# EAGLE design registers_half_copy (EAGLE 9.5.2)
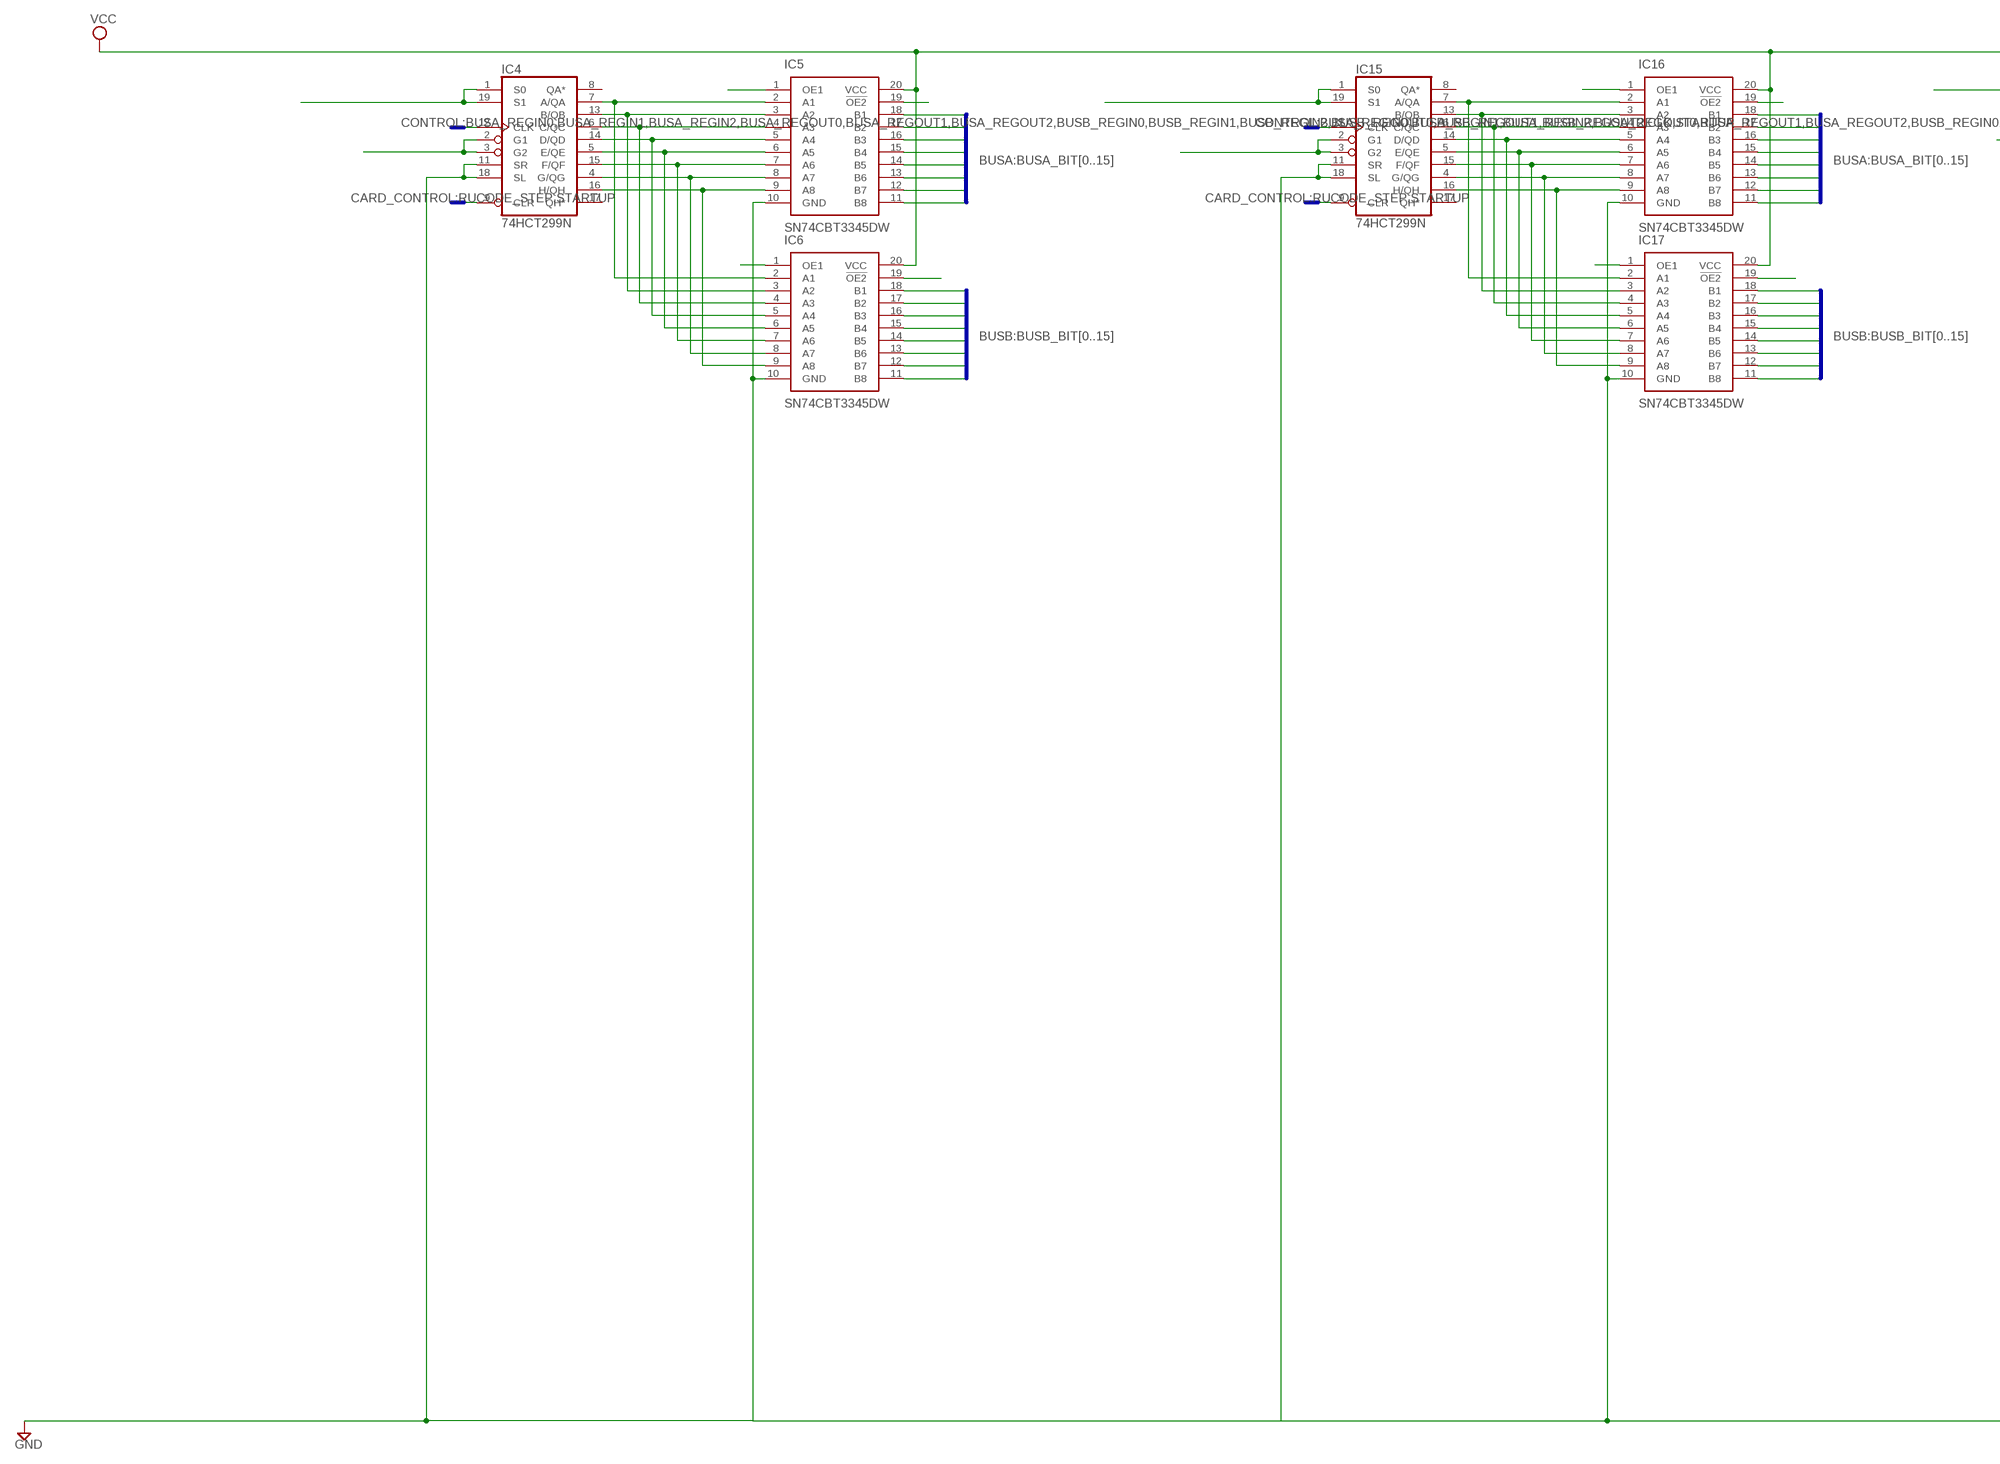
[diagram p0: schematic, sheet 1, part 1 of 2]
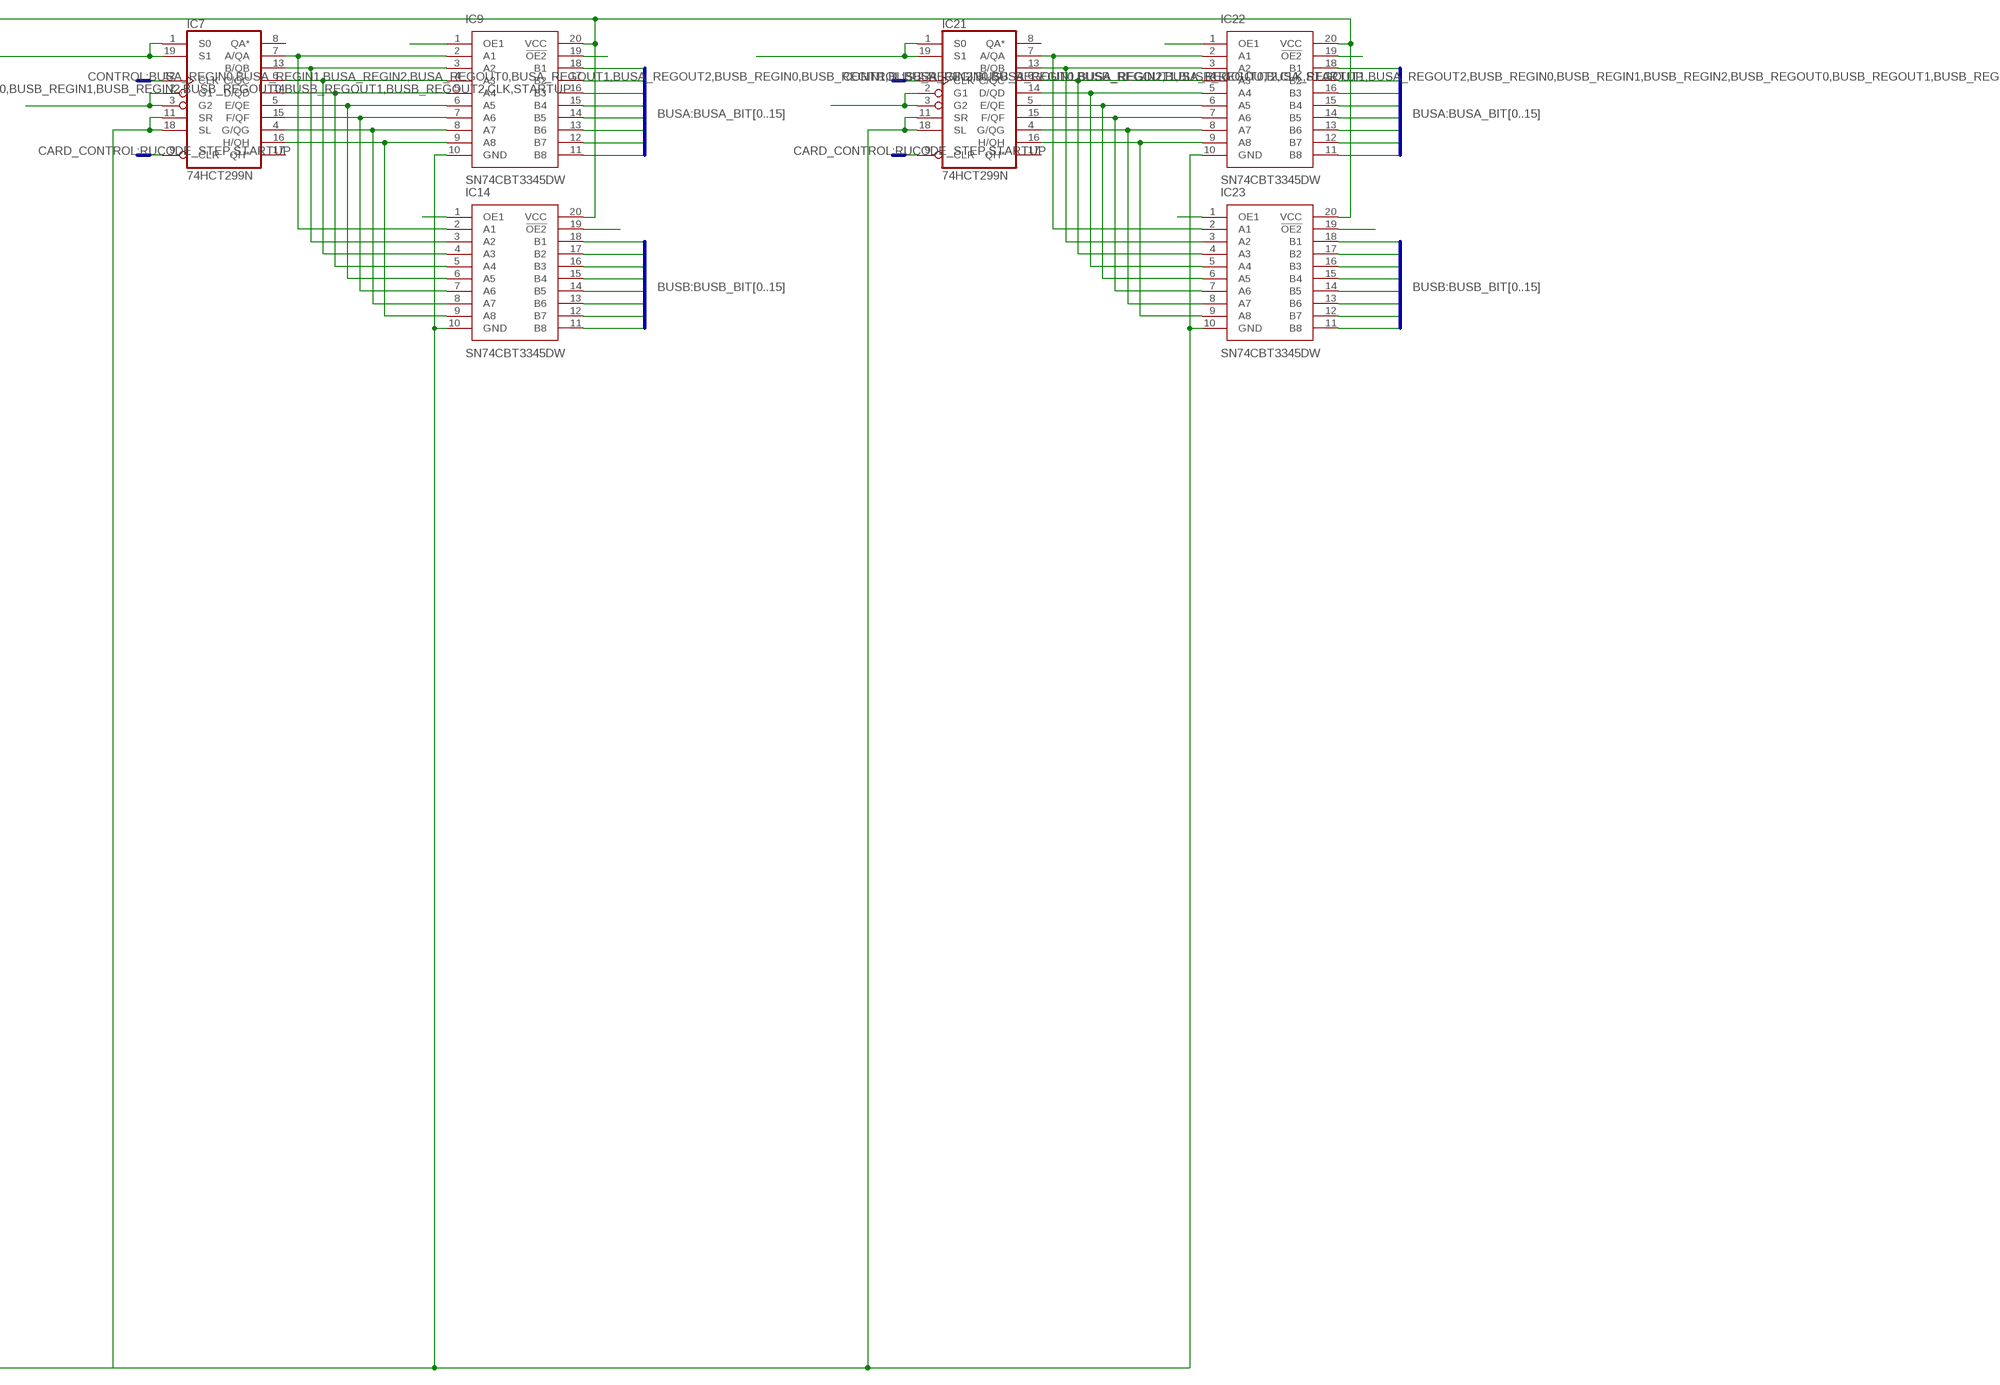
[diagram p1: schematic, sheet 1, part 2 of 2]

## Parts
IC4  74HCT299N  [DIL20]
IC5  SN74CBT3345DW  [SOIC127P1030X265-20N]
IC6  SN74CBT3345DW  [SOIC127P1030X265-20N]
IC7  74HCT299N  [DIL20]
IC9  SN74CBT3345DW  [SOIC127P1030X265-20N]
IC14  SN74CBT3345DW  [SOIC127P1030X265-20N]
IC15  74HCT299N  [DIL20]
IC16  SN74CBT3345DW  [SOIC127P1030X265-20N]
IC17  SN74CBT3345DW  [SOIC127P1030X265-20N]
IC21  74HCT299N  [DIL20]
IC22  SN74CBT3345DW  [SOIC127P1030X265-20N]
IC23  SN74CBT3345DW  [SOIC127P1030X265-20N]

## Nets
BUSA_BIT0: IC5.18(B1) IC9.18(B1) IC16.18(B1) IC22.18(B1)
BUSA_BIT1: IC5.17(B2) IC9.17(B2) IC16.17(B2) IC22.17(B2)
BUSA_BIT2: IC5.16(B3) IC9.16(B3) IC16.16(B3) IC22.16(B3)
BUSA_BIT3: IC5.15(B4) IC9.15(B4) IC16.15(B4) IC22.15(B4)
BUSA_BIT4: IC5.14(B5) IC9.14(B5) IC16.14(B5) IC22.14(B5)
BUSA_BIT5: IC5.13(B6) IC9.13(B6) IC16.13(B6) IC22.13(B6)
BUSA_BIT6: IC5.12(B7) IC9.12(B7) IC16.12(B7) IC22.12(B7)
BUSA_BIT7: IC5.11(B8) IC9.11(B8) IC16.11(B8) IC22.11(B8)
BUSB_BIT0: IC6.18(B1) IC14.18(B1) IC17.18(B1) IC23.18(B1)
BUSB_BIT1: IC6.17(B2) IC14.17(B2) IC17.17(B2) IC23.17(B2)
BUSB_BIT2: IC6.16(B3) IC14.16(B3) IC17.16(B3) IC23.16(B3)
BUSB_BIT3: IC6.15(B4) IC14.15(B4) IC17.15(B4) IC23.15(B4)
BUSB_BIT4: IC6.14(B5) IC14.14(B5) IC17.14(B5) IC23.14(B5)
BUSB_BIT5: IC6.13(B6) IC14.13(B6) IC17.13(B6) IC23.13(B6)
BUSB_BIT6: IC6.12(B7) IC14.12(B7) IC17.12(B7) IC23.12(B7)
BUSB_BIT7: IC6.11(B8) IC14.11(B8) IC17.11(B8) IC23.11(B8)
CLK: IC4.12(CLK) IC7.12(CLK) IC15.12(CLK) IC21.12(CLK)
GND: IC4.11(SR) IC4.18(SL) IC5.10(GND) IC6.10(GND) IC7.11(SR) IC7.18(SL) IC9.10(GND) IC14.10(GND) IC15.11(SR) IC15.18(SL) IC16.10(GND) IC17.10(GND) IC21.11(SR) IC21.18(SL) IC22.10(GND) IC23.10(GND)
N$1: IC5.19(!OE2)
N$2: IC23.1(OE1)
N$3: IC4.2(G1) IC4.3(G2)
N$4: IC4.1(S0) IC4.19(S1)
N$5: IC4.7(A/QA) IC5.2(A1) IC6.2(A1)
N$6: IC4.13(B/QB) IC5.3(A2) IC6.3(A2)
N$7: IC4.6(C/QC) IC5.4(A3) IC6.4(A3)
N$8: IC4.14(D/QD) IC5.5(A4) IC6.5(A4)
N$9: IC4.5(E/QE) IC5.6(A5) IC6.6(A5)
N$10: IC4.15(F/QF) IC5.7(A6) IC6.7(A6)
N$11: IC4.4(G/QG) IC5.8(A7) IC6.8(A7)
N$14: IC16.19(!OE2)
N$15: IC4.16(H/QH) IC5.9(A8) IC6.9(A8)
N$17: IC7.2(G1) IC7.3(G2)
N$18: IC17.19(!OE2)
N$19: IC7.1(S0) IC7.19(S1)
N$20: IC16.1(OE1)
N$22: IC7.7(A/QA) IC9.2(A1) IC14.2(A1)
N$23: IC7.13(B/QB) IC9.3(A2) IC14.3(A2)
N$24: IC7.6(C/QC) IC9.4(A3) IC14.4(A3)
N$25: IC7.14(D/QD) IC9.5(A4) IC14.5(A4)
N$26: IC17.1(OE1)
N$27: IC9.1(OE1)
N$28: IC7.5(E/QE) IC9.6(A5) IC14.6(A5)
N$29: IC14.1(OE1)
N$30: IC9.19(!OE2)
N$31: IC14.19(!OE2)
N$32: IC6.1(OE1)
N$33: IC6.19(!OE2)
N$34: IC5.1(OE1)
N$35: IC7.15(F/QF) IC9.7(A6) IC14.7(A6)
N$36: IC7.4(G/QG) IC9.8(A7) IC14.8(A7)
N$37: IC7.16(H/QH) IC9.9(A8) IC14.9(A8)
N$39: IC15.2(G1) IC15.3(G2)
N$40: IC15.1(S0) IC15.19(S1)
N$41: IC15.7(A/QA) IC16.2(A1) IC17.2(A1)
N$42: IC15.13(B/QB) IC16.3(A2) IC17.3(A2)
N$43: IC15.6(C/QC) IC16.4(A3) IC17.4(A3)
N$44: IC15.14(D/QD) IC16.5(A4) IC17.5(A4)
N$45: IC15.5(E/QE) IC16.6(A5) IC17.6(A5)
N$46: IC15.15(F/QF) IC16.7(A6) IC17.7(A6)
N$47: IC15.4(G/QG) IC16.8(A7) IC17.8(A7)
N$48: IC15.16(H/QH) IC16.9(A8) IC17.9(A8)
N$50: IC22.1(OE1)
N$52: IC22.19(!OE2)
N$53: IC23.19(!OE2)
N$61: IC21.2(G1) IC21.3(G2)
N$62: IC21.1(S0) IC21.19(S1)
N$63: IC21.7(A/QA) IC22.2(A1) IC23.2(A1)
N$64: IC21.13(B/QB) IC22.3(A2) IC23.3(A2)
N$65: IC21.6(C/QC) IC22.4(A3) IC23.4(A3)
N$66: IC21.14(D/QD) IC22.5(A4) IC23.5(A4)
N$67: IC21.5(E/QE) IC22.6(A5) IC23.6(A5)
N$68: IC21.15(F/QF) IC22.7(A6) IC23.7(A6)
N$69: IC21.4(G/QG) IC22.8(A7) IC23.8(A7)
N$70: IC21.16(H/QH) IC22.9(A8) IC23.9(A8)
STARTUP: IC4.9(CLR) IC7.9(CLR) IC15.9(CLR) IC21.9(CLR)
VCC: IC5.20(VCC) IC6.20(VCC) IC9.20(VCC) IC14.20(VCC) IC16.20(VCC) IC17.20(VCC) IC22.20(VCC) IC23.20(VCC)
Unconnected: IC4.8(QA*) IC4.17(QH*) IC7.8(QA*) IC7.17(QH*) IC15.8(QA*) IC15.17(QH*) IC21.8(QA*) IC21.17(QH*)

## Buses
CONTROL:BUSA_REGIN0,BUSA_REGIN1,BUSA_REGIN2,BUSA_REGOUT0,BUSA_REGOUT1,BUSA_REGOUT2,BUSB_REGIN0,BUSB_REGIN1,BUSB_REGIN2,BUSB_REGOUT0,BUSB_REGOUT1,BUSB_REGOUT2,CLK,STARTUP
CARD_CONTROL:RUCODE_STEP,STARTUP
BUSA:BUSA_BIT[0..15]
BUSB:BUSB_BIT[0..15]

## Power pins joined to a net without a drawn wire
GND: IC4.10(GND) IC7.10(GND) IC15.10(GND) IC21.10(GND)
VCC: IC4.20(VCC) IC7.20(VCC) IC15.20(VCC) IC21.20(VCC)

## Library data of the parts
IC4 IC7 IC15 IC21 = 74xx-eu:74*299: 8-bit universal SHIFT/STORAGE REGISTER
IC5 IC6 IC9 IC14 IC16 IC17 IC22 IC23 = SamacSys_Parts:SN74CBT3345DW: Texas Instruments SN74CBT3345DW, Bus Switch, 8 x 1:1, 4.5 5.5 V, 20-Pin SOIC Source: Datasheet <https://www.ti.com/lit/ds/symlink/sn74cbt3345.pdf>; DESCRIPTION: Texas Instruments SN74CBT3345DW, Bus Switch, 8 x 1:1, 4.5 5.5 V, 20-Pin SOIC; HEIGHT: 2.65mm; MANUFACTURER_NAME: Texas Instruments; MANUFACTURER_PART_NUMBER: SN74CBT3345DW

## Board
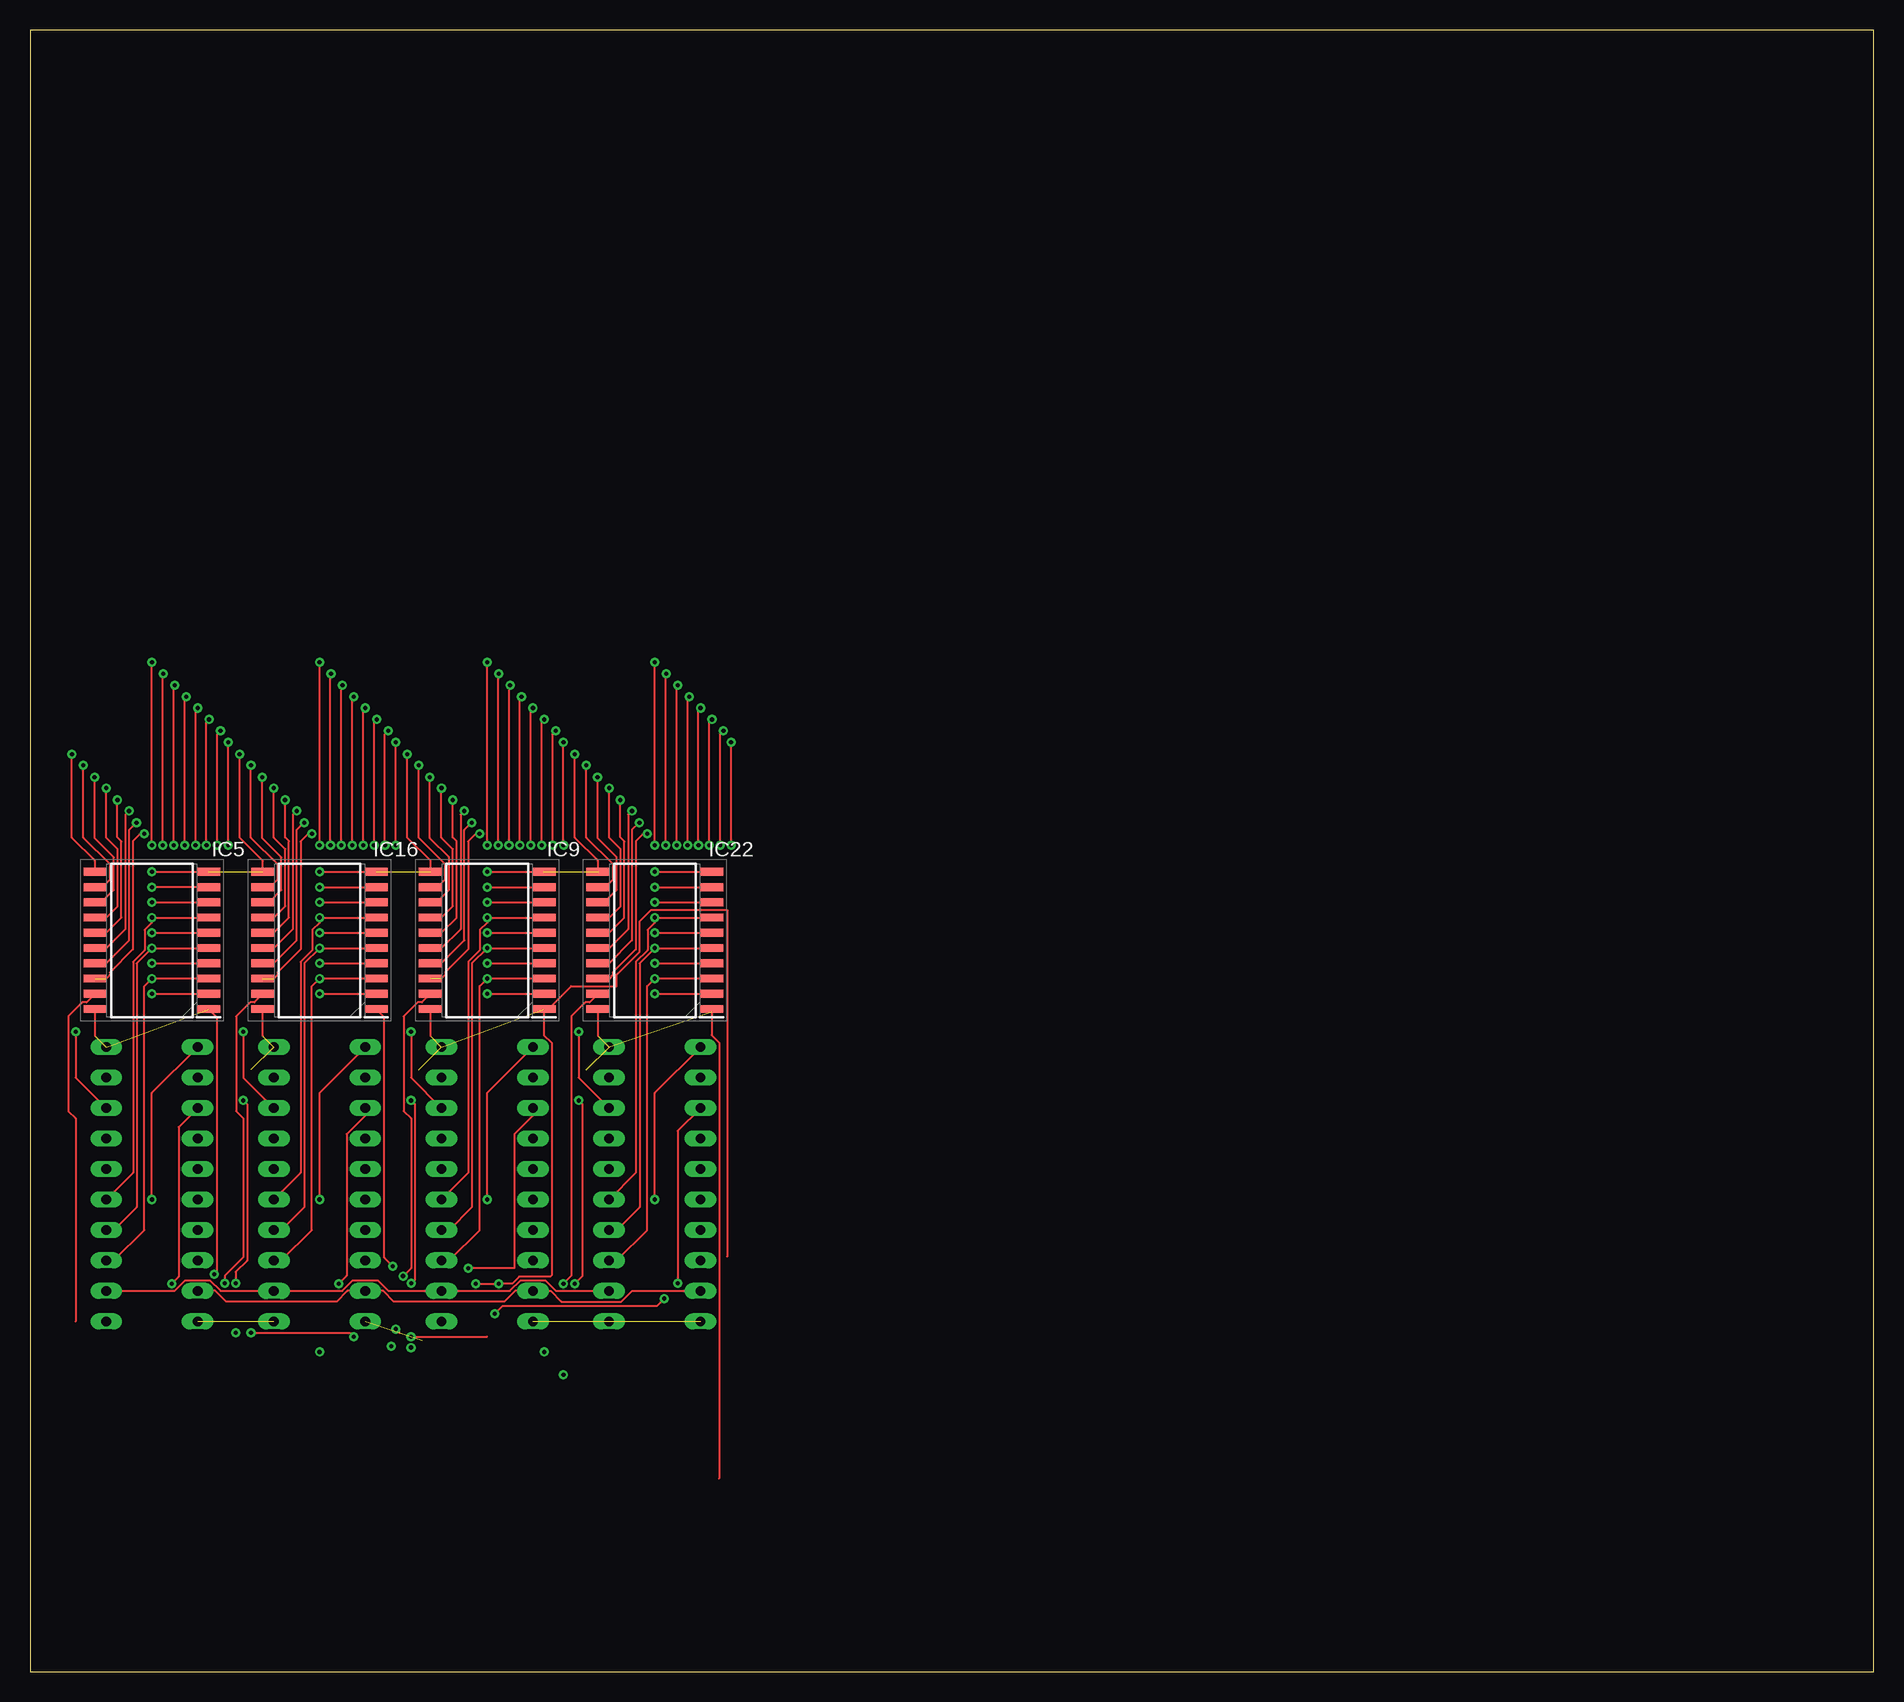
[diagram p2: board, top side]
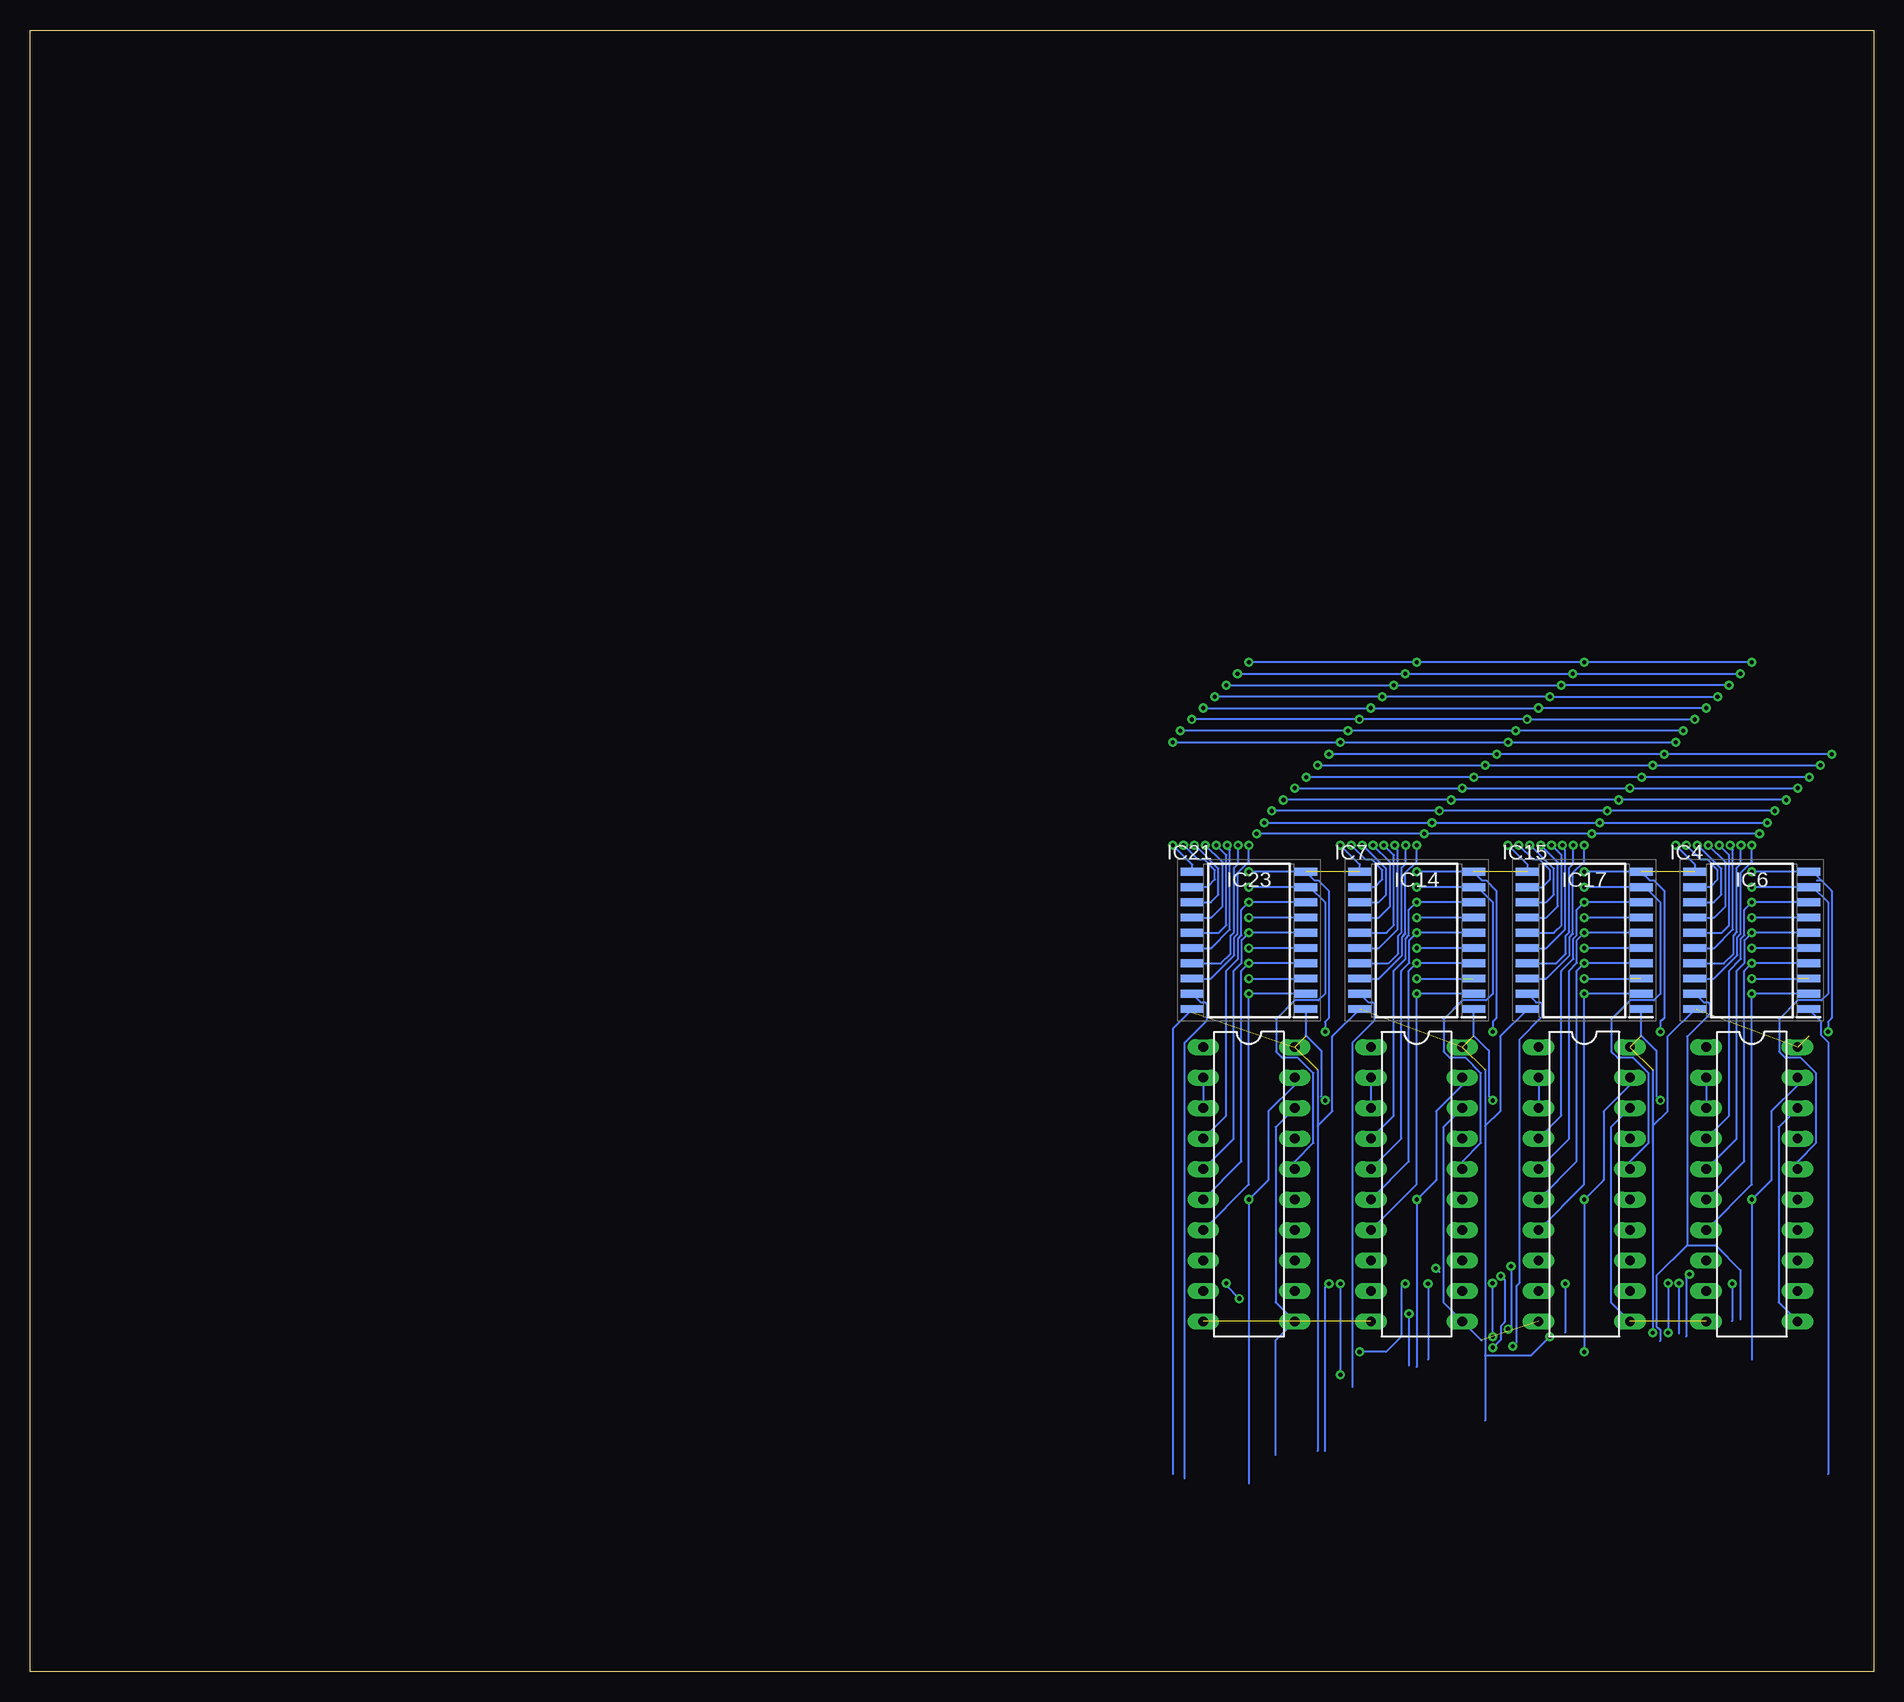
[diagram p3: board, bottom side, seen from below]

Size 153.65 x 136.83 mm. Coordinates in mm from the lower left corner, seen from the top.
Outline: 0,0 153.65,0 153.65,136.83 0,136.83 0,0
Copper layers (1*16): Top 0.035mm / dielectric 1.5mm / Bottom 0.035mm
Design rules "default *": minimum track width 6mil, minimum drill 0.35mm, track to track 6mil, track to pad 6mil, pad to pad 6mil, via to via 6mil, smd to smd 6mil, copper to edge 40mil, drill to drill 6mil, minimum pad ring 10mil, minimum via ring 8mil, stop-mask expansion 4mil, vias tented up to drill 0mil, thermal gap 10mil

### Footprints (pad centres in the part's own frame; a part is rotated, then mirrored left to right if it is on the bottom)
DIL20 = drill 0.813 long: 1 -11.43,-3.81; 2 -8.89,-3.81; 3 -6.35,-3.81; 4 -3.81,-3.81; 5 -1.27,-3.81; 6 1.27,-3.81; 7 3.81,-3.81; 8 6.35,-3.81; 9 8.89,-3.81; 10 11.43,-3.81; 11 11.43,3.81; 12 8.89,3.81; 13 6.35,3.81; 14 3.81,3.81; 15 1.27,3.81; 16 -1.27,3.81; 17 -3.81,3.81; 18 -6.35,3.81; 19 -8.89,3.81; 20 -11.43,3.81
SOIC127P1030X265-20N = smd 1.95 x 0.65: 1 -4.725,5.715; 2 -4.725,4.445; 3 -4.725,3.175; 4 -4.725,1.905; 5 -4.725,0.635; 6 -4.725,-0.635; 7 -4.725,-1.905; 8 -4.725,-3.175; 9 -4.725,-4.445; 10 -4.725,-5.715; 11 4.725,-5.715; 12 4.725,-4.445; 13 4.725,-3.175; 14 4.725,-1.905; 15 4.725,-0.635; 16 4.725,0.635; 17 4.725,1.905; 18 4.725,3.175; 19 4.725,4.445; 20 4.725,5.715

### Placement (x,y rotation side)
IC4  10.16,40.64 270 bottom
IC5  10.16,60.96 180 top
IC6  10.16,60.96 180 bottom
IC7  38.1,40.64 270 bottom
IC9  38.1,60.96 180 top
IC14  38.1,60.96 180 bottom
IC15  24.13,40.64 270 bottom
IC16  24.13,60.96 180 top
IC17  24.13,60.96 180 bottom
IC21  52.07,40.64 270 bottom
IC22  52.07,60.96 180 top
IC23  52.07,60.96 180 bottom

### Tracks (layer width: path | path; a pad name or v marks a point on that pad's centre or on a via)
BUSA_BIT0  (via drill 0.35)  (3 unrouted)
  Top 0.152: v9.53,69.85 9.21,69.85 8.57,69.22 8.57,60.21 6.67,58.31 6.67,58.1 6.35,57.78 | v23.5,69.85 23.18,69.85 22.54,69.22 22.54,60.21 20.64,58.31 20.64,58.1 20.32,57.78 | v37.47,69.85 37.15,69.85 36.51,69.22 36.51,60.21 34.61,58.31 34.61,58.1 34.29,57.78 | v51.44,69.85 51.12,69.85 50.48,69.22 50.48,60.21 48.58,58.31 48.58,58.1 48.26,57.78 IC22.18
  Bottom 0.152: v9.53,69.85 v23.5,69.85 v37.47,69.85 v51.44,69.85
BUSA_BIT1  (via drill 0.35)
  Top 0.152: v8.87,70.76 8.85,70.76 8.26,70.17 8.26,60.96 6.35,59.05 IC5.17 | v22.84,70.76 22.82,70.76 22.23,70.17 22.23,60.96 20.32,59.05 IC16.17 | v36.81,70.76 36.79,70.76 36.2,70.17 36.2,60.96 34.29,59.05 IC9.17 | v50.78,70.76 50.76,70.76 50.16,70.17 50.16,60.96 48.26,59.05 IC22.17
  Bottom 0.152: v50.78,70.76 v36.81,70.76 v22.84,70.76 v8.87,70.76
BUSA_BIT2  (via drill 0.35)
  Top 0.152: v8.26,71.75 7.94,71.44 7.94,61.91 6.35,60.33 IC5.16 | v22.23,71.75 21.91,71.44 21.91,61.91 20.32,60.33 IC16.16 | v36.2,71.75 35.88,71.44 35.88,61.91 34.29,60.33 IC9.16 | v50.16,71.75 49.85,71.44 49.85,61.91 48.26,60.33 IC22.16
  Bottom 0.152: v8.26,71.75 v22.23,71.75 v36.2,71.75 v50.16,71.75
BUSA_BIT3  (via drill 0.35)
  Top 0.152: v7.29,72.66 7.29,69.55 7.62,69.22 7.61,69.2 7.61,62.85 6.35,61.59 IC5.15 | v21.26,72.66 21.26,69.55 21.59,69.22 21.58,69.2 21.58,62.85 20.32,61.59 IC16.15 | v35.23,72.66 35.23,69.55 35.56,69.22 35.55,69.2 35.55,62.85 34.29,61.59 IC9.15 | v49.2,72.66 49.2,69.55 49.53,69.22 49.52,69.2 49.52,62.85 48.26,61.59 IC22.15
  Bottom 0.152: v7.29,72.66 v21.26,72.66 v35.23,72.66 v49.2,72.66
BUSA_BIT4  (via drill 0.35)
  Top 0.152: v6.35,73.66 6.35,69.53 7.3,68.58 7.3,63.82 6.35,62.87 IC5.14 | v20.32,73.66 20.32,69.53 21.27,68.58 21.27,63.82 20.32,62.87 IC16.14 | v34.29,73.66 34.29,69.53 35.24,68.58 35.24,63.82 34.29,62.87 IC9.14 | v48.26,73.66 48.26,69.53 49.21,68.58 49.21,63.82 48.26,62.87 IC22.14
  Bottom 0.152: v48.26,73.66 v34.29,73.66 v20.32,73.66 v6.35,73.66
BUSA_BIT5  (via drill 0.35)
  Top 0.152: IC5.13 5.95,64.14 6.99,65.17 6.99,67.89 5.38,69.49 v5.38,74.57 | IC16.13 19.92,64.14 20.95,65.17 20.95,67.89 19.35,69.49 v19.35,74.57 | IC9.13 33.89,64.14 34.92,65.17 34.92,67.89 33.32,69.49 v33.32,74.57 | IC22.13 47.86,64.14 48.9,65.17 48.9,67.89 47.29,69.49 v47.29,74.57
  Bottom 0.152: v5.38,74.57 v19.35,74.57 v33.32,74.57 v47.29,74.57
BUSA_BIT6  (via drill 0.35)
  Top 0.152: v4.45,75.56 4.45,69.53 6.68,67.3 6.68,66.04 6.04,65.41 IC5.12 | v18.41,75.56 18.41,69.53 20.65,67.3 20.65,66.04 20.02,65.41 IC16.12 | v32.38,75.56 32.38,69.53 34.62,67.3 34.62,66.04 33.98,65.41 IC9.12 | v46.35,75.56 46.35,69.53 48.59,67.3 48.59,66.04 47.95,65.41 IC22.12
  Bottom 0.152: v46.35,75.56 v32.38,75.56 v18.41,75.56 v4.45,75.56
BUSA_BIT7  (via drill 0.35)
  Top 0.152: v3.49,76.47 3.49,69.53 5.43,67.59 IC5.11 | v17.46,76.47 17.46,69.53 19.41,67.59 IC16.11 | v31.43,76.47 31.43,69.53 33.38,67.59 IC9.11 | v45.4,76.47 45.4,69.53 47.34,67.59 IC22.11
  Bottom 0.152: v3.49,76.47 v17.46,76.47 v31.43,76.47 v45.4,76.47
BUSB_BIT0  (via drill 0.35)
  Top 0.152: v10.16,68.9 v10.16,84.14 | v24.13,68.9 v24.13,84.14 | v38.1,68.9 v38.1,84.14 | v52.07,68.9 v52.07,84.14
  Bottom 0.152: IC6.18 13.34,57.78 11.38,59.74 11.38,61.24 11.1,61.52 11.1,66.59 10.16,67.53 v10.16,68.9 | IC17.18 27.3,57.78 25.35,59.74 25.35,61.24 25.07,61.52 25.07,66.59 24.13,67.53 v24.13,68.9 | IC14.18 41.27,57.78 39.32,59.74 39.32,61.24 39.04,61.52 39.04,66.59 38.1,67.53 v38.1,68.9 | IC23.18 55.24,57.78 53.29,59.74 53.29,61.24 53.01,61.52 53.01,66.59 52.07,67.53 v52.07,68.9 | v10.16,84.14 v24.13,84.14 v38.1,84.14 v52.07,84.14
BUSB_BIT1  (via drill 0.35)
  Top 0.152: v11.07,68.9 11.07,83.14 v11.11,83.19 | v25.04,68.9 25.04,83.14 v25.08,83.19 | v39.01,68.9 39.01,83.14 v39.05,83.19 | v52.98,68.9 52.98,83.14 v53.02,83.19
  Bottom 0.152: v11.07,68.9 11.07,67.35 11.4,67.02 11.4,61.64 11.68,61.37 11.68,59.87 12.5,59.05 IC6.17 | v25.04,68.9 25.04,67.35 25.38,67.02 25.38,61.64 25.65,61.37 25.65,59.87 26.47,59.05 IC17.17 | v39.01,68.9 39.01,67.35 39.34,67.02 39.34,61.64 39.62,61.37 39.62,59.87 40.44,59.05 IC14.17 | v52.98,68.9 52.98,67.35 53.31,67.02 53.31,61.64 53.59,61.37 53.59,59.87 54.41,59.05 IC23.17 | v53.02,83.19 v39.05,83.19 v25.08,83.19 v11.11,83.19
BUSB_BIT2  (via drill 0.35)
  Top 0.152: v11.98,68.9 11.98,82.14 v12.06,82.23 | v25.95,68.9 25.95,82.14 v26.04,82.23 | v39.92,68.9 39.92,82.14 v40.01,82.23 | v53.89,68.9 53.89,82.14 v53.98,82.23
  Bottom 0.152: IC6.16 13.31,60.33 11.75,61.89 11.75,68.49 11.98,68.72 v11.98,68.9 | IC17.16 27.28,60.33 25.72,61.89 25.72,68.49 25.95,68.72 v25.95,68.9 | IC14.16 41.25,60.33 39.69,61.89 39.69,68.49 39.92,68.72 v39.92,68.9 | IC23.16 55.22,60.33 53.66,61.89 53.66,68.49 53.89,68.72 v53.89,68.9 | v12.06,82.23 v26.04,82.23 v40.01,82.23 v53.98,82.23
BUSB_BIT3  (via drill 0.35)
  Top 0.152: v12.89,68.9 12.89,81.15 v13.02,81.28 | v26.86,68.9 26.86,81.15 v26.99,81.28 | v40.83,68.9 40.83,81.15 v40.96,81.28 | v54.8,68.9 54.8,81.15 v54.93,81.28
  Bottom 0.152: v12.89,68.9 12.05,68.06 12.05,62.23 12.69,61.59 IC6.15 | v26.86,68.9 26.02,68.06 26.02,62.23 26.66,61.59 IC17.15 | v40.83,68.9 39.99,68.06 39.99,62.23 40.63,61.59 IC14.15 | v54.8,68.9 53.96,68.06 53.96,62.23 54.6,61.59 IC23.15 | v13.02,81.28 v26.99,81.28 v40.96,81.28 v54.93,81.28
BUSB_BIT4  (via drill 0.35)
  Top 0.152: v13.79,68.9 13.79,80.15 v13.97,80.33 | v27.77,68.9 27.77,80.15 v27.94,80.33 | v41.73,68.9 41.73,80.15 v41.91,80.33 | v55.7,68.9 55.7,80.15 v55.88,80.33
  Bottom 0.152: IC6.14 13.31,62.87 12.36,63.82 12.36,67.46 v13.79,68.9 | IC17.14 27.28,62.87 26.33,63.82 26.33,67.46 v27.77,68.9 | IC14.14 41.25,62.87 40.3,63.82 40.3,67.46 v41.73,68.9 | IC23.14 55.22,62.87 54.27,63.82 54.27,67.46 v55.7,68.9 | v13.97,80.33 v27.94,80.33 v41.91,80.33 v55.88,80.33
BUSB_BIT5  (via drill 0.35)
  Top 0.152: v14.7,68.9 14.7,79.16 v14.92,79.38 | v28.67,68.9 28.67,79.16 v28.89,79.38 | v42.64,68.9 42.64,79.16 v42.86,79.38 | v56.61,68.9 56.61,79.16 v56.83,79.38
  Bottom 0.152: IC6.13 13.34,64.14 12.7,64.77 12.7,66.94 14.65,68.9 v14.7,68.9 | IC17.13 27.3,64.14 26.67,64.77 26.67,66.94 28.62,68.9 v28.67,68.9 | IC14.13 41.27,64.14 40.64,64.77 40.64,66.94 42.59,68.9 v42.64,68.9 | IC23.13 55.24,64.14 54.61,64.77 54.61,66.94 56.56,68.9 v56.61,68.9 | v14.92,79.38 v28.89,79.38 v42.86,79.38 v56.83,79.38
BUSB_BIT6  (via drill 0.35)
  Top 0.152: v15.61,68.9 15.61,78.16 v15.88,78.42 | v29.58,68.9 29.58,78.16 v29.84,78.42 | v43.55,68.9 43.55,78.16 v43.81,78.42 | v57.52,68.9 57.52,78.16 v57.78,78.42
  Bottom 0.152: v15.61,68.9 14.42,67.7 13.89,67.7 13.01,66.82 13.01,66.04 13.64,65.41 IC6.12 | v29.58,68.9 28.39,67.7 27.86,67.7 26.98,66.82 26.98,66.04 27.61,65.41 IC17.12 | v43.55,68.9 42.36,67.7 41.83,67.7 40.95,66.82 40.95,66.04 41.58,65.41 IC14.12 | v57.52,68.9 56.33,67.7 55.8,67.7 54.91,66.82 54.91,66.04 55.55,65.41 IC23.12 | v57.78,78.42 v43.81,78.42 v29.84,78.42 v15.88,78.42
BUSB_BIT7  (via drill 0.35)
  Top 0.152: v16.52,68.9 v16.51,68.91 v16.51,77.47 | v30.49,68.9 v30.48,68.91 v30.48,77.47 | v44.46,68.9 v44.45,68.91 v44.45,77.47 | v58.43,68.9 v58.42,68.91 v58.42,77.47
  Bottom 0.152: IC6.11 14.88,67.27 v16.51,68.9 v16.52,68.9 | IC17.11 28.86,67.27 v30.48,68.9 v30.49,68.9 | IC14.11 42.83,67.27 v44.45,68.9 v44.46,68.9 | IC23.11 56.8,67.27 v58.42,68.9 v58.43,68.9 | v58.42,77.47 v44.45,77.47 v30.48,77.47 v16.51,77.47
CLK
  Top 0.152: IC4.12 12.05,31.75 12.94,32.64 15,32.64 15.89,31.75 IC15.12 26.02,31.75 26.91,32.64 28.97,32.64 29.86,31.75 IC7.12 39.99,31.75 40.88,32.64 42.94,32.64 43.83,31.75 IC21.12
GND  (via drill 0.35)  (7 unrouted)
  Top 0.152: v3.81,53.34 3.81,49.53 IC4.18 | v10.16,66.67 IC5.10 | v24.13,66.67 IC16.10 | v38.1,66.67 IC9.10 | v52.07,66.67 IC22.10 | v17.78,53.34 17.78,49.53 IC15.18 | v31.75,53.34 31.75,49.53 IC7.18 | v45.72,53.34 45.72,49.53 IC21.18
  Bottom 0.152: IC4.18 7.94,45.4 7.94,30.8 IC4.11 | 4.72,65.96 4.37,65.96 4.29,65.88 | v3.81,53.34 3.81,54.18 3.5,54.48 3.5,65.1 4.29,65.88 | v10.16,66.67 IC6.10 5.08,66.67 4.29,65.88 | v24.13,66.67 IC17.10 18.69,65.96 18.34,65.96 17.48,65.1 17.48,54.48 17.78,54.18 v17.78,53.34 | IC15.18 21.91,45.4 21.91,30.8 IC15.11 | IC7.18 35.88,45.4 35.88,30.8 IC7.11 32.7,27.62 | v38.1,66.67 IC14.10 32.66,65.96 32.3,65.96 31.45,65.1 31.45,54.48 31.75,54.18 v31.75,53.34 | IC21.18 49.85,45.4 49.85,30.8 IC21.11 49.85,27.62 49.85,18.1 | v52.07,66.67 IC23.10 46.63,65.96 46.27,65.96 45.41,65.1 45.41,54.48 45.72,54.18 v45.72,53.34
N$1
  Top 0.152: IC5.19 4.72,55.8 4.37,55.8 3.2,54.64 3.2,46.74 3.81,46.13 3.81,29.21
N$2  (via drill 0.35)
  Top 0.152: v45.72,47.62 46.04,47.31 46.04,32.99 v45.4,32.36
  Bottom 0.152: v45.72,47.62 46.05,47.95 46.05,51.78 47.34,53.07 IC23.1 | v45.4,32.36 45.43,32.36 45.72,32.07 45.72,18.4
N$3  (via drill 0.35)
  Top 0.152: IC4.3 12.38,45.4 12.38,32.94 v11.8,32.36
  Bottom 0.152: IC4.2 IC4.3 | v11.8,32.36 11.8,29.25
N$4  (via drill 0.35)
  Top 0.152: v10.16,39.37 10.16,48.26 IC4.1
  Bottom 0.152: IC4.19 6.35,48.91 8.53,46.72 8.53,41 v10.16,39.37 10.16,26.02
N$5  (via drill 0.35)
  Top 0.152: v10.16,56.52 IC5.2
  Bottom 0.152: IC6.2 v10.16,56.52 10.16,40.64 IC4.7
N$6  (via drill 0.35)
  Top 0.152: IC5.3 v10.16,57.78 9.53,57.15 9.53,36.83 6.99,34.29 IC4.13
  Bottom 0.152: v10.16,57.78 IC6.3
N$7  (via drill 0.35)
  Top 0.152: v10.16,59.05 IC5.4
  Bottom 0.152: IC6.4 v10.16,59.05 10.79,58.42 10.79,42.55 IC4.6
N$8  (via drill 0.35)
  Top 0.152: IC5.5 v10.16,60.33 8.89,59.05 8.89,38.73 6.99,36.83 IC4.14
  Bottom 0.152: IC6.5 v10.16,60.33
N$9  (via drill 0.35)
  Top 0.152: v10.16,61.59 IC5.6
  Bottom 0.152: IC6.6 v10.16,61.59 10.77,60.99 10.77,59.08 11.43,58.42 11.43,44.45 IC4.5
N$10  (via drill 0.35)
  Top 0.152: IC5.7 v10.16,62.87 10.16,62.45 9.55,61.85 9.55,60.15 8.59,59.18 8.59,41.6 IC4.15
  Bottom 0.152: IC6.7 v10.16,62.87
N$11  (via drill 0.35)
  Top 0.152: v10.16,64.14 IC5.8
  Bottom 0.152: IC6.8 v10.16,64.14 10.79,63.5 10.79,61.39 11.07,61.11 11.07,59.41 12.06,58.42 12.06,46.35 IC4.4
N$14  (via drill 0.35)
  Top 0.152: IC16.19 18.69,55.8 18.34,55.8 17.17,54.64 17.17,46.74 17.78,46.13 17.78,34.56 16.24,33.02 v16.24,32.38
  Bottom 0.152: v16.24,32.38 16.24,28.21
N$15  (via drill 0.35)
  Top 0.152: IC5.9 v10.16,65.41
  Bottom 0.152: v10.16,65.41 IC6.9 5.08,65.41 3.81,64.13 3.81,56.52 4.37,55.96 6.34,55.96 7.9,54.4 7.9,51.7 7.38,51.18 6.08,51.18 4.8,49.9 4.8,44.08 6.35,42.53 IC4.16
N$17  (via drill 0.35)
  Top 0.152: IC7.3 41.91,46.37 40.36,44.82 40.36,33.66 v36.51,33.66
  Bottom 0.152: IC7.2 IC7.3 | 36.2,33.34 v36.51,33.66
N$18  (via drill 0.35)
  Bottom 0.152: IC17.19 28.14,55.8 27.79,55.8 27.65,55.66 27.65,54.58 29.53,52.7 29.53,32.4 29.79,32.13 29.79,27.45 v30.1,27.14
N$19  (via drill 0.35)
  Top 0.152: v38.1,39.37 38.1,48.26 IC7.1
  Bottom 0.152: IC7.19 34.29,48.91 36.47,46.72 36.47,41 v38.1,39.37 38.1,25.4
N$20  (via drill 0.35)
  Top 0.152: IC16.1 29.53,54.57 29.53,34.53 v30.23,33.82 | 30.8,28.26 v30.48,28.57
  Bottom 0.152: v30.23,33.82 30.23,28.74 30.48,28.49 v30.48,28.57
N$22  (via drill 0.35)
  Top 0.152: v38.1,56.52 IC9.2
  Bottom 0.152: IC14.2 v38.1,56.52 38.1,40.64 IC7.7
N$23  (via drill 0.35)
  Top 0.152: IC9.3 v38.1,57.78 37.47,57.15 37.47,36.83 34.92,34.29 IC7.13
  Bottom 0.152: v38.1,57.78 IC14.3
N$24  (via drill 0.35)
  Top 0.152: v38.1,59.05 IC9.4
  Bottom 0.152: IC14.4 v38.1,59.05 38.73,58.42 38.73,42.55 IC7.6
N$25  (via drill 0.35)
  Top 0.152: IC9.5 v38.1,60.33 36.83,59.05 36.83,38.73 34.92,36.83 IC7.14
  Bottom 0.152: IC14.5 v38.1,60.33
N$26  (via drill 0.35)
  Top 0.152: v17.78,47.62 18.09,47.32 18.09,34.28 17.14,33.34 v17.14,32.38
  Bottom 0.152: v17.78,47.62 18.11,47.95 18.11,51.78 19.41,53.07 IC17.1 | v17.14,32.38 v17.14,28.26
N$27  (via drill 0.35)
  Top 0.152: v37.15,32.36 v39.05,32.36 40.17,32.36 40.76,32.94 43.34,32.94 43.46,33.06 43.46,52.44 42.83,53.07 IC9.1 43.18,55.24 45.09,57.15 48.9,57.15 48.9,58.1 50.8,60.01 50.8,62.55 51.75,63.5 58.1,63.5 58.1,34.61
  Bottom 0.152: v37.15,32.36 37.15,26.04 | v39.05,32.36 39.37,32.04 39.37,27.94 40.64,26.67 v42.85,26.67
N$28  (via drill 0.35)
  Top 0.152: v38.1,61.59 IC9.6
  Bottom 0.152: IC14.6 v38.1,61.59 38.71,60.99 38.71,59.08 39.37,58.42 39.37,44.45 IC7.5
N$29  (via drill 0.35)
  Top 0.152: v31.75,47.62 32.07,47.31 32.07,32.67 v31.78,32.38 | v31.75,27.94 38.1,27.94
  Bottom 0.152: v31.75,47.62 32.08,47.95 32.08,51.78 33.38,53.07 IC14.1 | v31.78,32.38 31.78,27.97 v31.75,27.94
N$30  (via drill 0.35)
  Top 0.152: IC9.19 32.66,55.8 32.3,55.8 31.14,54.64 31.14,46.74 31.75,46.13 31.75,33.66 v31.09,32.99
  Bottom 0.152: v31.09,32.99 30.77,32.67 30.77,29.14 31.09,28.83 31.09,27.69 v31.75,27.03
N$31
  Bottom 0.152: IC14.19 42.11,55.8 41.76,55.8 41.62,55.66 41.62,54.28 43.46,52.44 43.46,23.76
N$32
  Bottom 0.152: IC6.1 4.42,54.23 4.42,53.09 3.81,52.48 3.81,16.51
N$33
  Bottom 0.152: IC6.19 14.17,55.8 13.81,55.8 13.68,55.66 13.68,54.83 15.56,52.95 15.56,35.56 | 17.81,27.59 17.81,28.51 18.11,28.81 18.11,33.01 15.56,35.56 | 11.11,29.37 11.11,33.5 13.18,35.56 15.56,35.56
N$34  (via drill 0.35)
  Top 0.152: IC5.1 15.56,54.57 15.56,33.34 v15.36,33.14
  Bottom 0.152: v15.36,33.14 15.63,32.87 15.63,27.96
N$35  (via drill 0.35)
  Top 0.152: IC9.7 v38.1,62.87 38.1,62.45 37.49,61.85 37.49,60.15 36.52,59.18 36.52,41.6 IC7.15
  Bottom 0.152: IC14.7 v38.1,62.87
N$36  (via drill 0.35)
  Top 0.152: v38.1,64.14 IC9.8
  Bottom 0.152: IC14.8 v38.1,64.14 38.73,63.5 38.73,61.39 39.01,61.11 39.01,59.41 40.01,58.42 40.01,46.35 IC7.4
N$37  (via drill 0.35)
  Top 0.152: v38.1,65.41 IC9.9
  Bottom 0.152: v38.1,65.41 IC14.9 33.02,65.41 31.75,64.13 31.75,56.52 32.3,55.96 34.28,55.96 35.84,54.4 35.84,51.7 35.32,51.18 34.02,51.18 32.74,49.9 32.74,44.08 34.29,42.53 IC7.16
N$39  (via drill 0.35)
  Top 0.152: IC15.3 27.94,46.37 26.39,44.82 26.39,33.03 v25.72,32.36
  Bottom 0.152: IC15.2 IC15.3 | v25.72,32.36 25.72,28.27
N$40  (via drill 0.35)
  Top 0.152: v24.13,39.37 24.13,48.26 IC15.1
  Bottom 0.152: IC15.19 20.32,48.91 22.5,46.72 22.5,41 v24.13,39.37 v24.13,26.67
N$41  (via drill 0.35)
  Top 0.152: v24.13,56.52 IC16.2
  Bottom 0.152: IC17.2 v24.13,56.52 24.13,40.64 IC15.7
N$42  (via drill 0.35)
  Top 0.152: IC16.3 v24.13,57.78 23.5,57.15 23.5,36.83 20.95,34.29 IC15.13
  Bottom 0.152: v24.13,57.78 IC17.3
N$43  (via drill 0.35)
  Top 0.152: v24.13,59.05 IC16.4
  Bottom 0.152: IC17.4 v24.13,59.05 24.77,58.42 24.77,42.55 IC15.6
N$44  (via drill 0.35)
  Top 0.152: IC16.5 v24.13,60.33 22.86,59.05 22.86,38.73 20.95,36.83 IC15.14
  Bottom 0.152: IC17.5 v24.13,60.33
N$45  (via drill 0.35)
  Top 0.152: v24.13,61.59 IC16.6
  Bottom 0.152: IC17.6 v24.13,61.59 24.74,60.99 24.74,59.08 25.4,58.42 25.4,44.45 IC15.5
N$46  (via drill 0.35)
  Top 0.152: IC16.7 v24.13,62.87 24.13,62.45 23.52,61.85 23.52,60.15 22.55,59.18 22.55,41.6 IC15.15
  Bottom 0.152: IC17.7 v24.13,62.87
N$47  (via drill 0.35)
  Top 0.152: v24.13,64.14 IC16.8
  Bottom 0.152: IC17.8 v24.13,64.14 24.77,63.5 24.77,61.39 25.04,61.11 25.04,59.41 26.04,58.42 26.04,46.35 IC15.4
N$48  (via drill 0.35)
  Top 0.152: v24.13,65.41 IC16.9
  Bottom 0.152: v24.13,65.41 IC17.9 19.05,65.41 17.78,64.13 17.78,56.52 18.34,55.96 20.31,55.96 21.87,54.4 21.87,51.7 21.35,51.18 20.05,51.18 18.77,49.9 18.77,44.08 20.32,42.53 IC15.16
N$50
  Top 0.152: IC22.1 56.8,53.07 57.43,52.44 57.43,16.14
N$52  (via drill 0.35)
  Top 0.152: IC22.19 46.63,55.8 46.27,55.8 45.11,54.64 45.11,33.02 v44.45,32.36
  Bottom 0.152: v44.45,32.36 v44.45,24.77
N$53
  Bottom 0.152: IC23.19 56.08,55.8 55.73,55.8 55.59,55.66 55.59,54.28 57.43,52.44 57.43,16.14
N$61  (via drill 0.35)
  Top 0.152: IC21.3 53.98,45.09 v53.98,32.38 | v38.73,29.84 39.37,30.48 52.23,30.48 v52.86,31.11
  Bottom 0.152: IC21.2 IC21.3 | v38.73,29.84 38.73,25.56 | v52.86,31.11 53.98,32.23 v53.98,32.38
N$62  (via drill 0.35)
  Top 0.152: v52.07,39.37 52.07,48.26 IC21.1
  Bottom 0.152: IC21.19 48.26,48.91 50.44,46.72 50.44,41 v52.07,39.37 52.07,15.72
N$63  (via drill 0.35)
  Top 0.152: v52.07,56.52 IC22.2
  Bottom 0.152: IC23.2 v52.07,56.52 52.07,40.64 IC21.7
N$64  (via drill 0.35)
  Top 0.152: IC22.3 v52.07,57.78 51.44,57.15 51.44,36.83 48.9,34.29 IC21.13
  Bottom 0.152: v52.07,57.78 IC23.3
N$65  (via drill 0.35)
  Top 0.152: v52.07,59.05 IC22.4
  Bottom 0.152: IC23.4 v52.07,59.05 52.7,58.42 52.7,42.55 IC21.6
N$66  (via drill 0.35)
  Top 0.152: IC22.5 v52.07,60.33 50.8,59.05 50.8,38.73 48.9,36.83 IC21.14
  Bottom 0.152: IC23.5 v52.07,60.33
N$67  (via drill 0.35)
  Top 0.152: v52.07,61.59 IC22.6
  Bottom 0.152: IC23.6 v52.07,61.59 52.68,60.99 52.68,59.08 53.34,58.42 53.34,44.45 IC21.5
N$68  (via drill 0.35)
  Top 0.152: IC22.7 v52.07,62.87 52.07,62.45 51.46,61.85 51.46,60.15 50.49,59.18 50.49,41.6 IC21.15
  Bottom 0.152: IC23.7 v52.07,62.87
N$69  (via drill 0.35)
  Top 0.152: v52.07,64.14 IC22.8
  Bottom 0.152: IC23.8 v52.07,64.14 52.7,63.5 52.7,61.39 52.98,61.11 52.98,59.41 53.98,58.42 53.98,46.35 IC21.4
N$70  (via drill 0.35)
  Top 0.152: v52.07,65.41 IC22.9
  Bottom 0.152: v52.07,65.41 IC23.9 46.99,65.41 45.72,64.13 45.72,56.52 46.27,55.96 48.25,55.96 49.81,54.4 49.81,51.7 49.29,51.18 47.99,51.18 46.71,49.9 46.71,44.08 48.26,42.53 IC21.16
STARTUP
  Top 0.152: IC21.9 50.18,31.75 49.29,30.86 44.29,30.86 43.4,31.75 IC7.9 40.42,31.75 39.53,30.86 30.32,30.86 29.43,31.75 IC15.9 26.45,31.75 25.56,30.86 16.35,30.86 15.46,31.75 IC4.9
VCC  (via drill 0.35)  (10 unrouted)
  Top 0.152: 5.71,55.24 IC5.20 5.43,52.98 | 19.68,55.24 IC16.20 19.41,52.98 | 33.66,55.24 IC9.20 33.38,52.98 | 47.62,55.24 IC22.20 47.34,52.98 | v26.99,27.94 26.67,28.26 v18.41,28.26
  Bottom 0.152: 32.38,50.16 32.38,45.5 | 46.35,50.16 46.35,45.5 | 32.38,45.5 31.14,46.74 31.14,52.96 IC17.20 | 46.35,45.5 45.11,46.74 45.11,52.96 IC14.20 | 18.41,45.5 17.17,46.74 17.17,52.96 IC6.20 | 32.38,45.5 32.38,26.35 | 32.38,26.35 32.38,20.95 | 18.41,50.16 18.41,45.5 | 56.8,54.97 IC23.20 58.42,53.62 58.42,16.51 | 18.41,45.5 v18.41,28.26 | 46.35,45.5 46.35,18.41 | 32.38,26.35 28.57,26.35 v26.99,27.94